# Altium schematic sheet 701C Power Button.SchDoc
size B
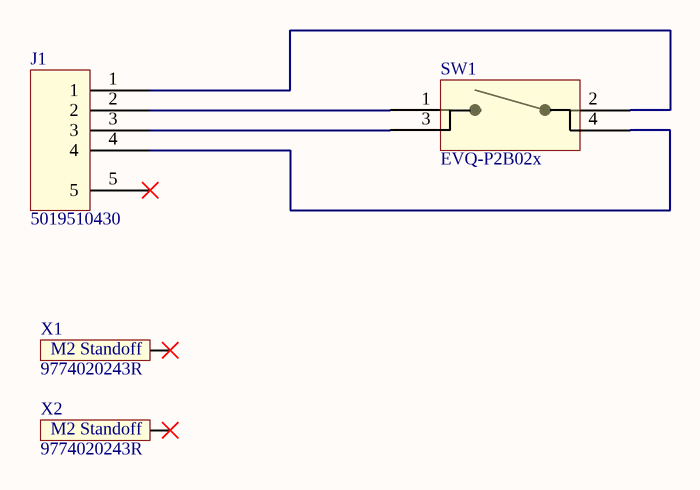
[diagram p0: 701C Power Button.SchDoc]

## Parts
J1  5019510430  [5019510430]
SW1  EVQ-P2B02x  [EVQ-P2B02x]
X1  9774020243R  [9774020243R]
X2  9774020243R  [9774020243R]

## Nets
NetJ1_1: J1.1 SW1.2
NetJ1_2: J1.2 SW1.1
NetJ1_3: J1.3 SW1.3
NetJ1_4: J1.4 SW1.4

Not connected (* = marked no-connect by the designer): J1 5*; X1 1*; X2 1*

## Notes on the sheet
- (in symbol 9774020243R) M2 Standoff

## Library data of the parts
J1 = 5019510430: 4 Position FFC, FPC Connector Contacts, Vertical - 1 Sided 0.020" (0.50mm) Surface Mount
SW1 = EVQ-P2B02x: SWITCH TACTILE SPST-NO 0.02A 15V